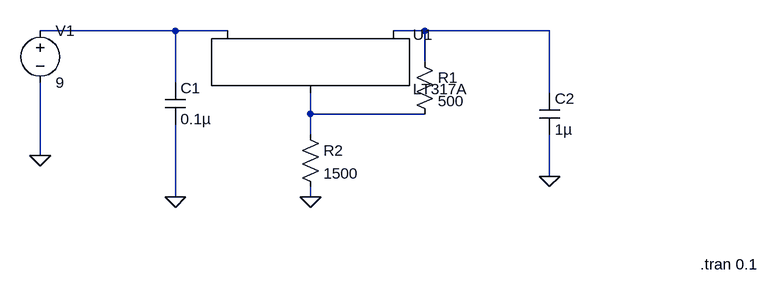
[diagram p0: schematic PMU.asc]
PMU.asc, the LTspice schematic file:
Version 4.1
SHEET 1 880 680
WIRE -64 112 -272 112
WIRE 16 112 -64 112
WIRE 320 112 272 112
WIRE 512 112 320 112
WIRE 320 160 320 112
WIRE -64 192 -64 112
WIRE 512 208 512 112
WIRE 144 240 144 208
WIRE 320 240 144 240
WIRE 144 272 144 240
WIRE -272 304 -272 192
WIRE 512 336 512 272
WIRE -64 368 -64 256
WIRE 144 368 144 352
FLAG -272 304 0
FLAG -64 368 0
FLAG 144 368 0
FLAG 512 336 0
SYMBOL PowerProducts\\LT317A 144 112 R0
SYMATTR InstName U1
SYMBOL voltage -272 96 R0
WINDOW 123 0 0 Left 0
WINDOW 39 0 0 Left 0
SYMATTR InstName V1
SYMATTR Value 9
SYMBOL res 304 144 R0
SYMATTR InstName R1
SYMATTR Value 500
SYMBOL res 128 256 R0
SYMATTR InstName R2
SYMATTR Value 1500
SYMBOL cap -80 192 R0
SYMATTR InstName C1
SYMATTR Value 0.1µ
SYMBOL cap 496 208 R0
SYMATTR InstName C2
SYMATTR Value 1µ
TEXT 744 472 Left 2 !.tran 0.1

The netlist it stands for:
* PMU.asc
X§U1 N003 N002 N001 LT317A
V1 N001 0 9
R1 N002 N003 500
R2 N003 0 1500
C1 N001 0 0.1µ
C2 N002 0 1µ
.tran 0.1
.lib LTC.lib
.backanno
.end